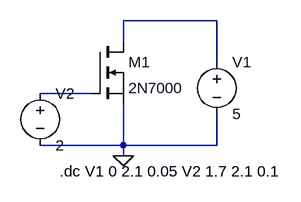
[diagram p0: schematic nmos_circuit_2.asc]
nmos_circuit_2.asc, the LTspice schematic file:
Version 4
SHEET 1 880 680
WIRE 256 48 112 48
WIRE 112 80 112 48
WIRE 256 112 256 48
WIRE 64 160 -16 160
WIRE 112 240 112 176
WIRE 112 240 -16 240
WIRE 256 240 256 192
WIRE 256 240 112 240
WIRE 112 256 112 240
FLAG 112 256 0
SYMBOL voltage 256 96 R0
WINDOW 123 0 0 Left 2
WINDOW 39 0 0 Left 2
SYMATTR InstName V1
SYMATTR Value 5
SYMBOL nmos 64 80 R0
SYMATTR InstName M1
SYMATTR Value 2N7000
SYMBOL voltage -16 144 R0
WINDOW 123 0 0 Left 2
WINDOW 39 0 0 Left 2
SYMATTR InstName V2
SYMATTR Value 2
TEXT 14 280 Left 2 !.dc V1 0 2.1 0.05 V2 1.7 2.1 0.1

The netlist it stands for:
* nmos_circuit_2.asc
V1 N001 0 5
M1 N001 N002 0 0 2N7000
V2 N002 0 2
.model NMOS NMOS
.model PMOS PMOS
.lib standard.mos
.dc V1 0 2.1 0.05 V2 1.7 2.1 0.1
.backanno
.end